# EAGLE design mb_01-5 (EAGLE 7.7.0)
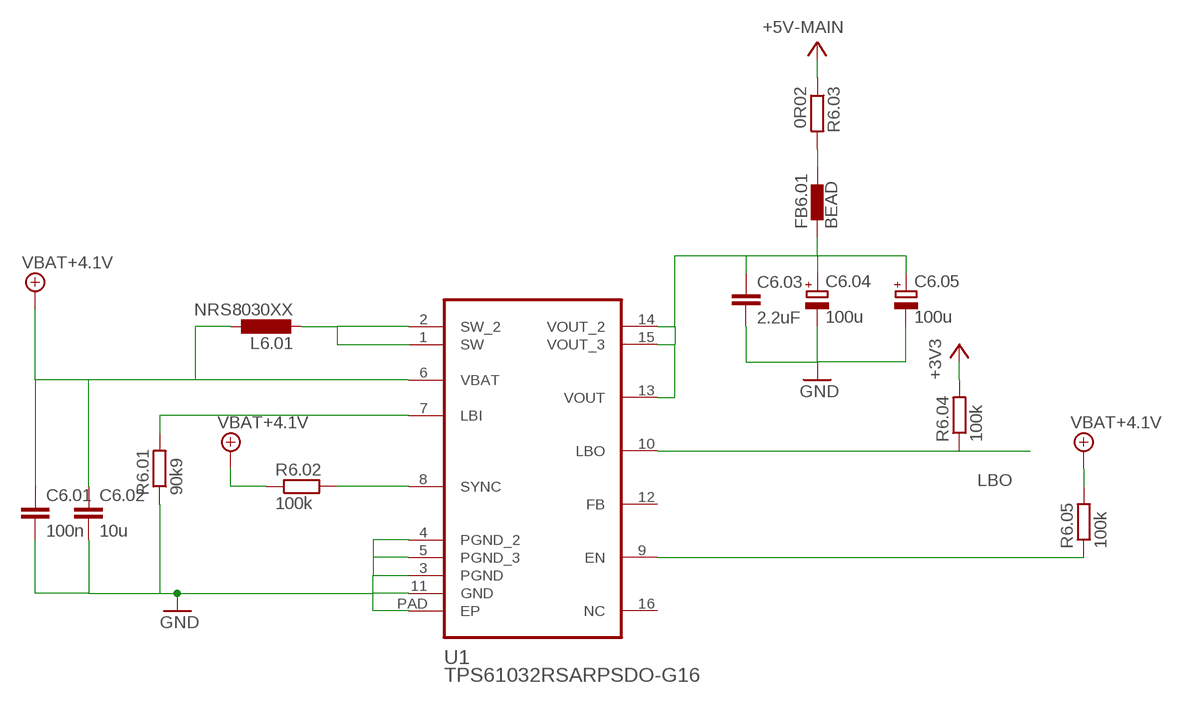
[diagram p0: schematic, sheet 1]

## Parts
C6.01  100n  C-EUC0402  [C0402]
C6.02  10u  C-EUC0603  [C0603]
C6.03  2.2uF  C-EUC0603  [C0603]
C6.04  100u  CPOL-29172312  [C-2312]
C6.05  100u  CPOL-29172312  [C-2312]
FB6.01  BEAD  BLM15HB121SN1  [0402]
L6.01  NRS8030XX  [TAIYO-YUDEN.NRS8030T4R7MJGJ]
R6.01  90k9  R-EU_R0402  [R0402]
R6.02  100k  R-EU_R0402  [R0402]
R6.03  0R02  R-EU_R0805  [R0805]
R6.04  100k  R-EU_R0402  [R0402]
R6.05  100k  R-EU_R0402  [R0402]
U1  TPS61032RSARPSDO-G16  [R-PDSO-G16]

## Nets
+3V3: R6.04.2
+4.1V: C6.01.1 C6.02.1 L6.01.1 R6.02.1 R6.05.2 U1.6(VBAT) ; supply symbol labelled VBAT+4.1V
+5V: R6.03.1 ; supply symbol labelled +5V-MAIN
GND: C6.01.2 C6.02.2 C6.03.2 C6.04.N(-) C6.05.N(-) R6.01.1 U1.3(PGND) U1.4(PGND_2) U1.5(PGND_3) U1.11(GND) U1.PAD(EP)
LBO: R6.04.1 U1.10(LBO)
N$36: FB6.01.2 R6.03.2
N$37: R6.05.1 U1.9(EN)
N$39: L6.01.2 U1.1(SW) U1.2(SW_2)
N$40: R6.01.2 U1.7(LBI)
N$41: R6.02.2 U1.8(SYNC)
N$43: C6.03.1 C6.04.P(+) C6.05.P(+) FB6.01.1 U1.13(VOUT) U1.14(VOUT_2) U1.15(VOUT_3)
Unconnected: U1.12(FB) U1.16(NC)

## Library data of the parts
C6.01-C6.03 = rcl:C-EU: CAPACITOR, European symbol
C6.04 C6.05 = kitt.psvs:CPOL-2917
FB6.01 = inductors:BLM15H: EMIFIL (R) Chip Ferrite Bead for GHz Noise Source: http://www.murata.com/ Ferrite Bead BLM15H.pdf
L6.01 = kitt.psvs:NRS8030XX
R6.01-R6.05 = rcl:R-EU_: RESISTOR, European symbol
U1 = kitt.ic:TPS61032RSAR: SYNCHRONOUS BOOST CONVERTER

## Board
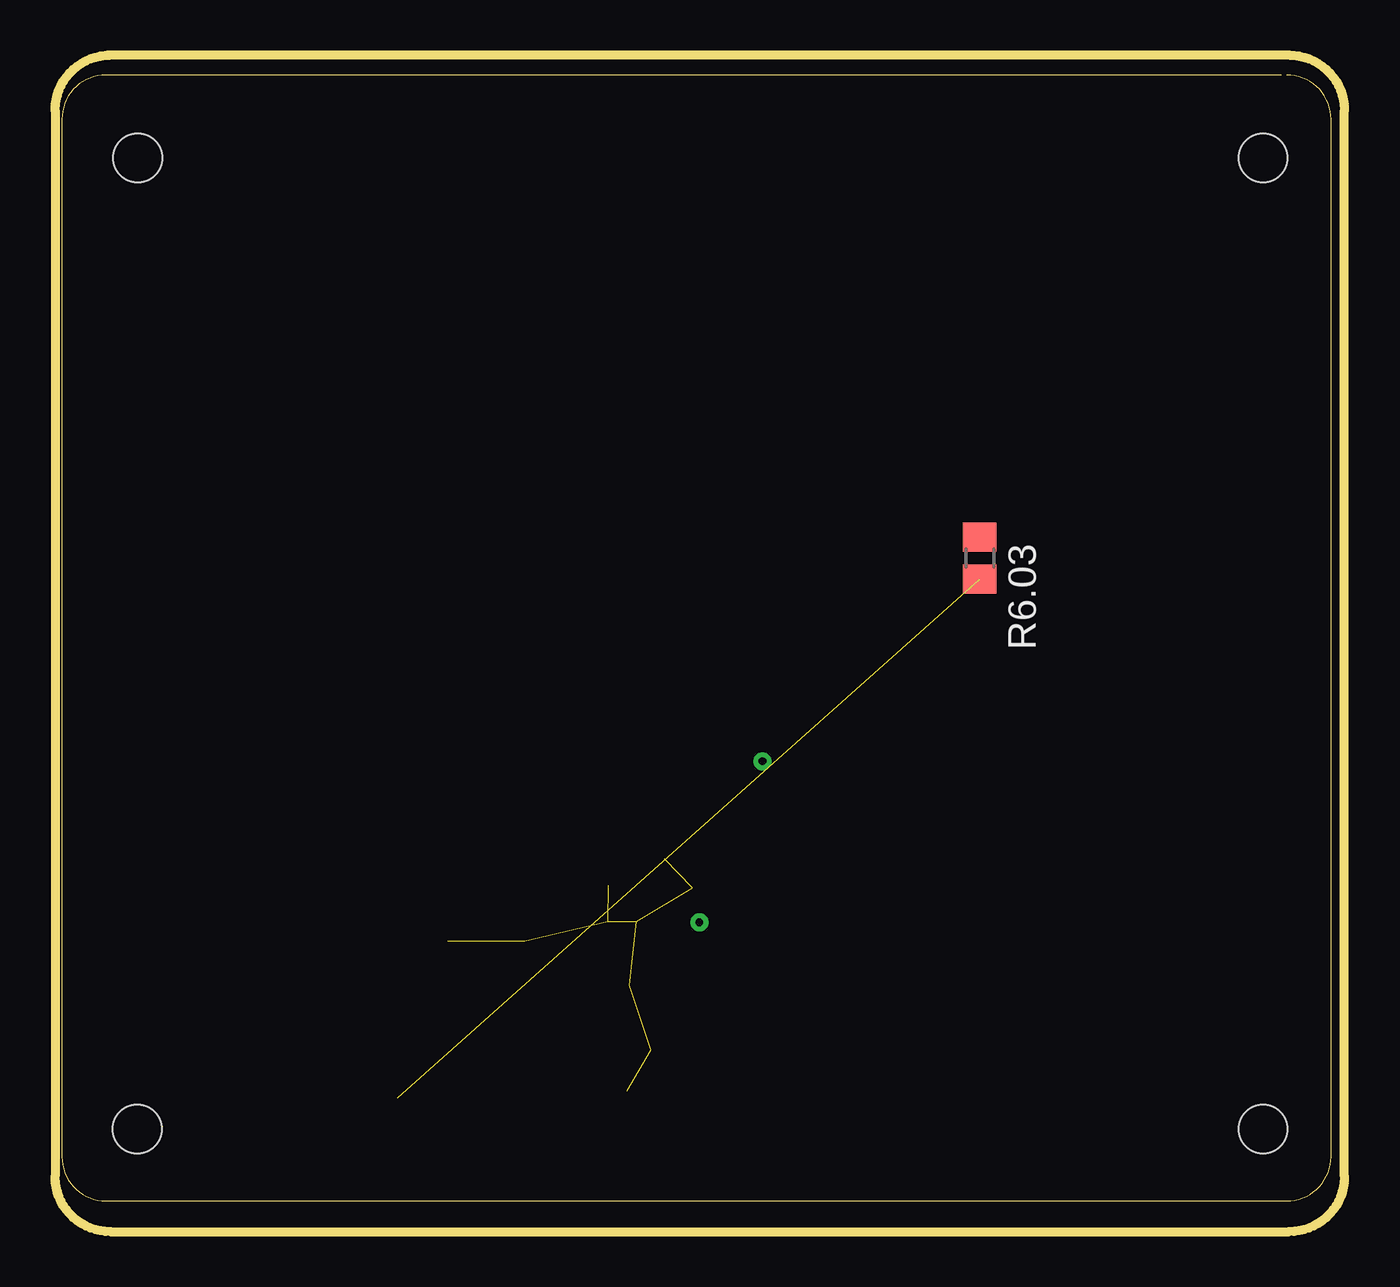
[diagram p1: board, top side]
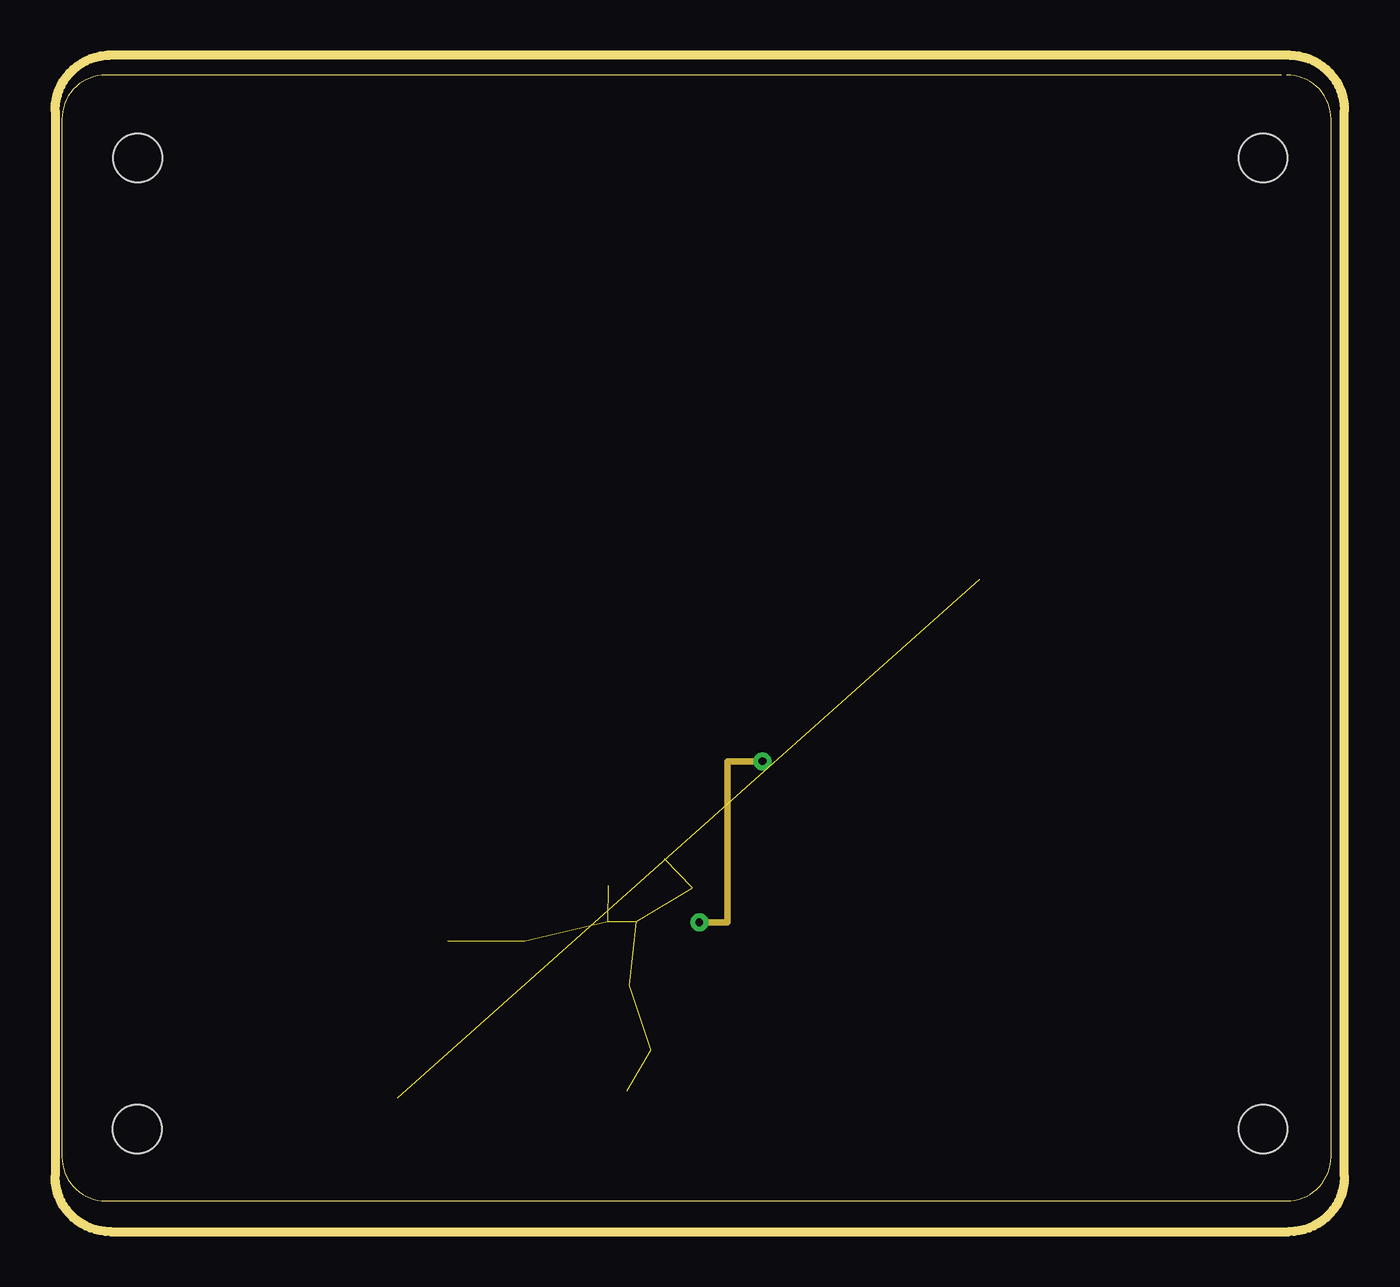
[diagram p2: board, inner layer Route2]
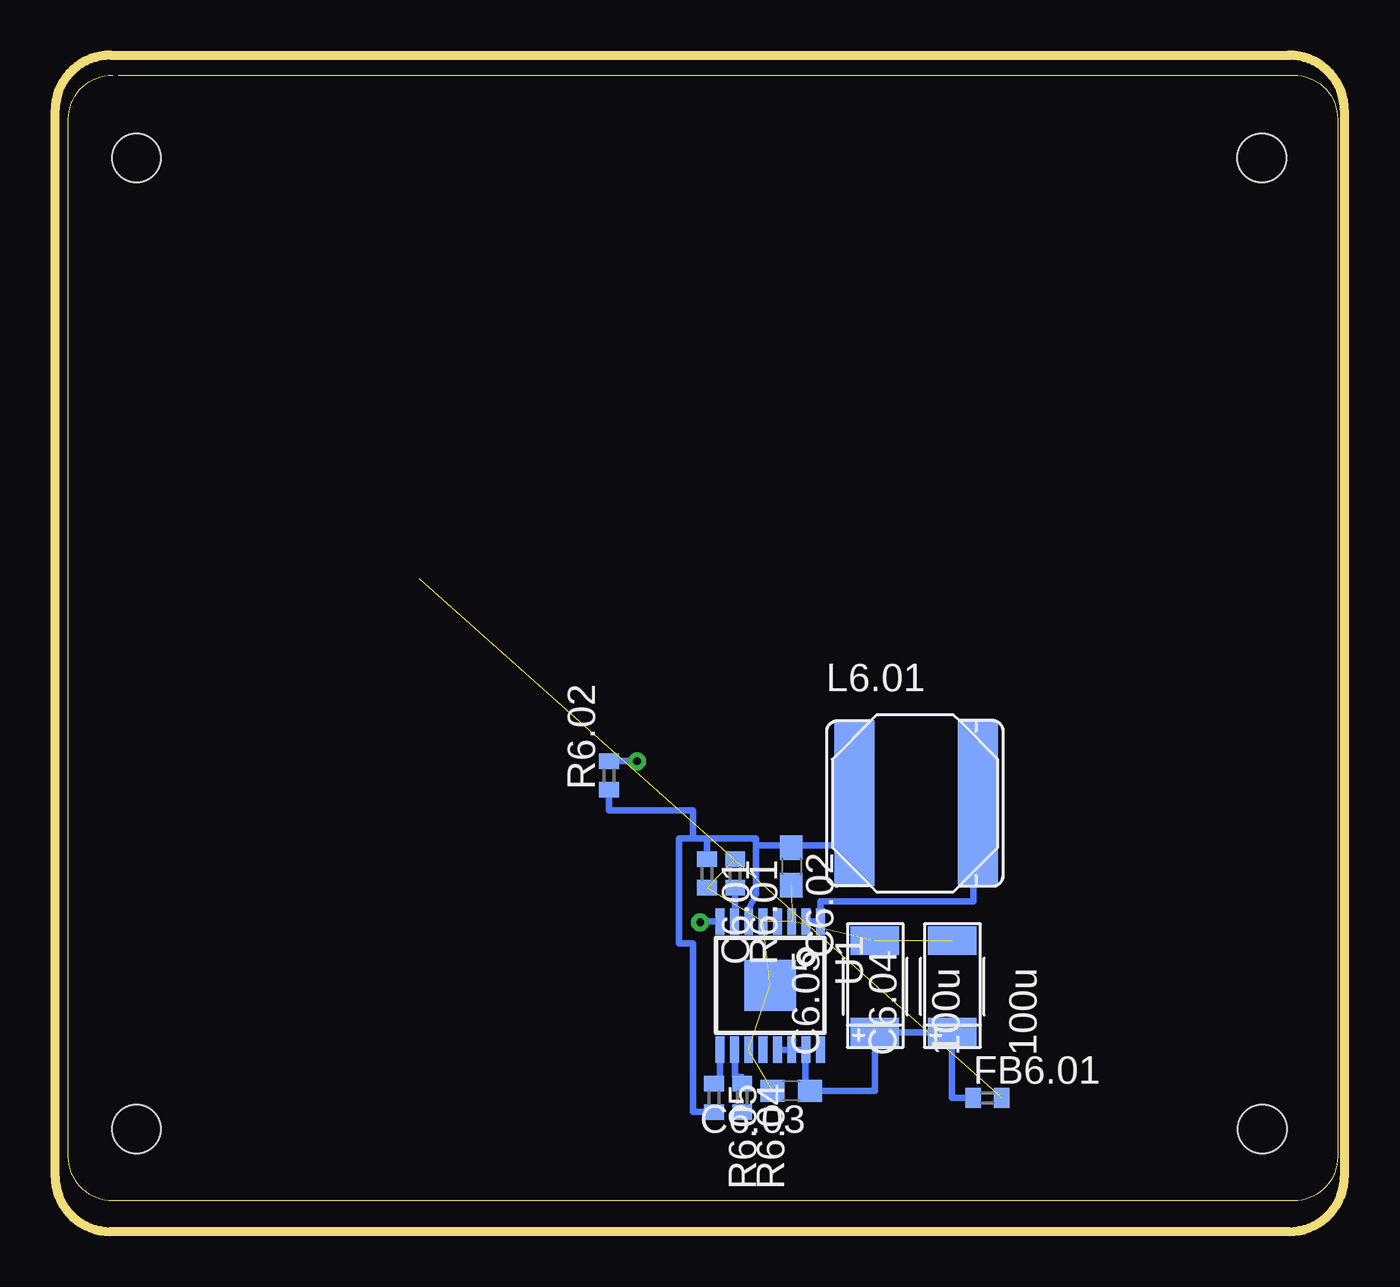
[diagram p3: board, bottom side, seen from below]

Size 58.4 x 53.3 mm. Coordinates in mm from the lower left corner, seen from the top.
Outline: 55.55,52.4 2.3,52.4 arc90 0.3,50.4 0.3,3.4 arc90 2.3,1.4 55.8,1.4 arc90 57.8,3.4 57.8,50.4 arc90 55.8,52.4
Outline: 2.5,53.3 arc90 0,50.8 0,2.5 arc90 2.5,0 55.9,0 arc90 58.4,2.5 58.4,50.8 arc90 55.9,53.3 2.4,53.3
Copper layers (1*2+3*4+5*6+7*16): Top 0.035mm / dielectric 0.2mm / Route2 0.035mm / dielectric 0.15mm / Route3 0.035mm / dielectric 0.2mm / layer 4 0.035mm / dielectric 0.15mm / layer 5 0.035mm / dielectric 0.2mm / layer 6 0.035mm / dielectric 0.15mm / layer 7 0.035mm / dielectric 0.2mm / Bottom 0.035mm
Design rules "default *": minimum track width 6mil, minimum drill 0.25mm, track to track 6mil, track to pad 8mil, pad to pad 8mil, via to via 6mil, smd to smd 8mil, copper to edge 12mil, drill to drill 24mil, minimum pad ring 9mil, minimum via ring 9mil, stop-mask expansion 3mil, vias tented up to drill 0mil, thermal gap 12mil
Holes 2.2 mm at 3.72,4.65 54.72,4.65 3.74,48.64 54.72,48.64
Milling: 4 lines

### Footprints (pad centres in the part's own frame; a part is rotated, then mirrored left to right if it is on the bottom)
C0402 = smd 0.7 x 0.9: 1 -0.65,0; 2 0.65,0
C0603 = smd 1.1 x 1: 1 -0.85,0; 2 0.85,0
C-2312 = smd 1.3 x 2.2: N 2.032,0.022; P -2.108,0.022
0402 = smd 0.7 x 0.9: 1 -0.65,0; 2 0.65,0
TAIYO-YUDEN.NRS8030T4R7MJGJ = smd 1.8 x 7.5: 1 -2.54,0; 2 3.06,0
R0402 = smd 0.7 x 0.9: 1 -0.65,0; 2 0.65,0
R0805 = smd 1.3 x 1.5: 1 -0.95,0; 2 0.95,0
R-PDSO-G16 = smd 0.4 x 1.2: 1 -2.275,-2.9; 2 -1.625,-2.9; 3 -0.975,-2.9; 4 -0.325,-2.9; 5 0.325,-2.9; 6 0.975,-2.9; 7 1.625,-2.9; 8 2.275,-2.9; 9 2.275,2.9; 10 1.625,2.9; 11 0.975,2.9; 12 0.325,2.9; 13 -0.325,2.9; 14 -0.975,2.9; 15 -1.625,2.9; 16 -2.275,2.9 | smd 2.31 x 2.31: PAD 0,0

### Placement (x,y rotation side)
C6.01  28.86,16.23 270 bottom
C6.02  25.05,16.55 270 bottom
C6.03  25.05,6.39 180 bottom
C6.04  17.75,11.15 90 bottom
C6.05  21.24,11.15 90 bottom
FB6.01  16.16,6.07 0 bottom
L6.01  19.66,19.41 0 bottom
R6.01  27.59,16.23 270 bottom
R6.02  33.31,20.67 90 bottom
R6.03  41.88,30.52 270 top
R6.04  27.28,6.07 270 bottom
R6.05  28.55,6.07 270 bottom
U1  26.01,11.15 180 bottom
U$1  [REF_GCB2_TS]  3.78,0.35 0 top
U$2  [REF_GCB2_BS]  67.6,-8.22 0 bottom  (outside the outline)

### Tracks (layer width: path | path; a pad name or v marks a point on that pad's centre or on a via)
+4.1V
  Bottom 0.305: C6.01.1 28.86,17.82 | 26.64,17.5 25.05,17.5 | 25.05,17.5 C6.02.1 | 25.05,17.5 22.2,17.5 L6.01.1 | U1.6 26.96,14.05 26.96,14.64 26.64,15.28 26.64,17.5 | R6.02.1 33.31,19.09 29.5,19.09 29.5,17.82 | 29.5,17.82 28.86,17.82 | R6.05.2 28.55,5.43 29.5,5.43 29.5,13.05 30.13,13.05 30.13,17.82 29.5,17.82 | 28.86,17.82 26.64,17.82 26.64,17.5
GND  (10 unrouted)
LBO
  Bottom 0.305: U1.10 27.59,8.25 27.59,7.02 27.28,7.02 R6.04.1
N$36  (1 unrouted)
N$37
  Bottom 0.305: R6.05.1 28.28,6.72 U1.9
N$39
  Bottom 0.305: U1.2 U1.1 | U1.1 23.78,14.05 | L6.01.2 16.8,19.41 16.8,14.96 23.73,14.96 U1.1
N$40
  Bottom 0.305: U1.7 27.59,14.05 R6.01.2
N$41  (via drill 0.35 pad 0.6)
  Route2 0.305: v29.18,14.01 30.45,14.01 30.45,21.31 v32.04,21.31
  Bottom 0.305: R6.02.2 32.36,21.32 v32.04,21.31 | U1.8 29.18,14.05 v29.18,14.01
N$43
  Bottom 0.305: FB6.01.1 17.77,6.07 C6.04.P C6.05.P 21.27,6.39 C6.03.1 24.2,6.7 24.42,6.7 24.42,8.25 U1.15 U1.14 U1.13

### Text on the board
Milling: EAGLE EDU LIMIT
Reference: Motor Leads --> | <-- Rail Power Leads